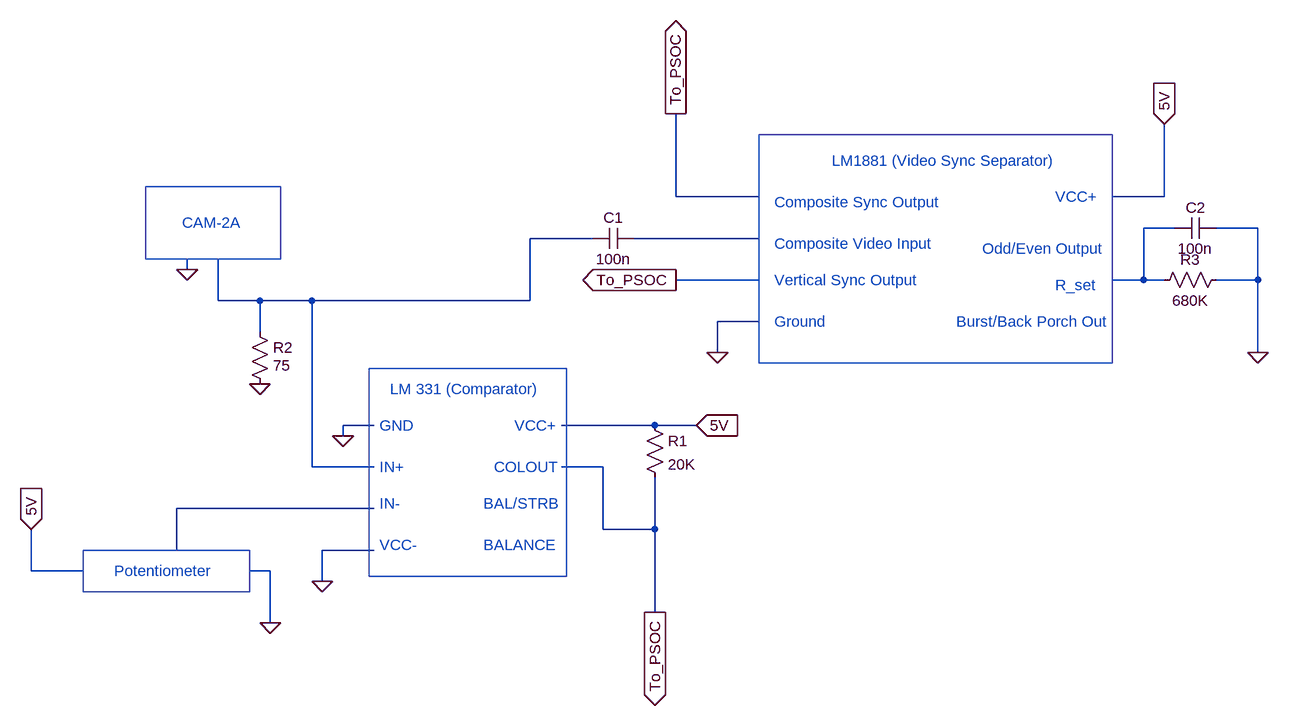
[diagram p0: schematic comparator_circuit.asc]
comparator_circuit.asc, the LTspice schematic file:
Version 4
SHEET 1 1716 872
WIRE 800 48 800 -80
WIRE 928 48 800 48
WIRE 1552 48 1552 -64
WIRE 1552 48 1472 48
WIRE 1568 96 1520 96
WIRE 1696 96 1632 96
WIRE 672 112 576 112
WIRE 928 112 736 112
WIRE 48 160 48 144
WIRE 928 176 800 176
WIRE 1520 176 1520 96
WIRE 1520 176 1472 176
WIRE 1552 176 1520 176
WIRE 1696 176 1696 96
WIRE 1696 176 1632 176
WIRE 96 208 96 144
WIRE 160 208 96 208
WIRE 240 208 160 208
WIRE 576 208 576 112
WIRE 576 208 240 208
WIRE 928 240 864 240
WIRE 160 256 160 208
WIRE 864 288 864 240
WIRE 1696 288 1696 176
WIRE 336 400 288 400
WIRE 768 400 624 400
WIRE 832 400 768 400
WIRE 288 416 288 400
WIRE 240 464 240 208
WIRE 336 464 240 464
WIRE 688 464 624 464
WIRE 336 528 32 528
WIRE 688 560 688 464
WIRE 768 560 768 480
WIRE 768 560 688 560
WIRE 32 592 32 528
WIRE 336 592 256 592
WIRE -192 624 -192 560
WIRE -112 624 -192 624
WIRE 176 624 144 624
WIRE 256 640 256 592
WIRE 768 688 768 560
WIRE 176 704 176 624
FLAG 48 160 0
FLAG 160 336 0
FLAG -192 560 5V
IOPIN -192 560 In
FLAG 176 704 0
FLAG 288 416 0
FLAG 256 640 0
FLAG 832 400 5V
IOPIN 832 400 In
FLAG 768 688 To_PSOC
IOPIN 768 688 Out
FLAG 864 288 0
FLAG 800 176 To_PSOC
IOPIN 800 176 Out
FLAG 800 -80 To_PSOC
IOPIN 800 -80 Out
FLAG 1696 288 0
FLAG 1552 -64 5V
IOPIN 1552 -64 In
SYMBOL res 144 240 R0
WINDOW 3 36 68 Left 2
SYMATTR InstName R2
SYMATTR Value 75
SYMBOL res 752 384 R0
SYMATTR InstName R1
SYMATTR Value 20K
SYMBOL cap 736 96 R90
WINDOW 0 0 32 VBottom 2
WINDOW 3 32 32 VTop 2
SYMATTR InstName C1
SYMATTR Value 100n
SYMBOL res 1648 160 R90
WINDOW 0 0 56 VBottom 2
WINDOW 3 32 56 VTop 2
SYMATTR InstName R3
SYMATTR Value 680K
SYMBOL cap 1632 80 R90
WINDOW 0 0 32 VBottom 2
WINDOW 3 32 32 VTop 2
SYMATTR InstName C2
SYMATTR Value 100n
TEXT 40 88 Left 2 ;CAM-2A
TEXT 344 400 Left 2 ;GND
TEXT 344 464 Left 2 ;IN+
TEXT 344 520 Left 2 ;IN-
TEXT 344 584 Left 2 ;VCC-
TEXT 552 400 Left 2 ;VCC+
TEXT 520 464 Left 2 ;COLOUT
TEXT 504 520 Left 2 ;BAL/STRB
TEXT 504 584 Left 2 ;BALANCE
TEXT 360 344 Left 2 ;LM 331 (Comparator)
TEXT -64 624 Left 2 ;Potentiometer
TEXT 952 56 Left 2 ;Composite Sync Output
TEXT 952 120 Left 2 ;Composite Video Input
TEXT 952 176 Left 2 ;Vertical Sync Output
TEXT 952 240 Left 2 ;Ground
TEXT 1384 48 Left 2 ;VCC+
TEXT 1272 128 Left 2 ;Odd/Even Output
TEXT 1384 184 Left 2 ;R_set
TEXT 1232 240 Left 2 ;Burst/Back Porch Out
TEXT 1040 -8 Left 2 ;LM1881 (Video Sync Separator)
RECTANGLE Normal 632 632 328 312
RECTANGLE Normal 192 144 -16 32
RECTANGLE Normal 144 656 -112 592
RECTANGLE Normal 1472 304 928 -48

The netlist it stands for:
* comparator_circuit.asc
R2 N002 0 75
R1 5V To_PSOC 20K
C1 N003 N002 100n
R3 0 N001 680K
C2 0 N001 100n
* CAM-2A
* GND
* IN+
* IN-
* VCC-
* VCC+
* COLOUT
* BAL/STRB
* BALANCE
* LM 331 (Comparator)
* Potentiometer
* Composite Sync Output
* Composite Video Input
* Vertical Sync Output
* Ground
* VCC+
* Odd/Even Output
* R_set
* Burst/Back Porch Out
* LM1881 (Video Sync Separator)
.backanno
.end